# EAGLE schematic cs3 (EAGLE 8.5.1)
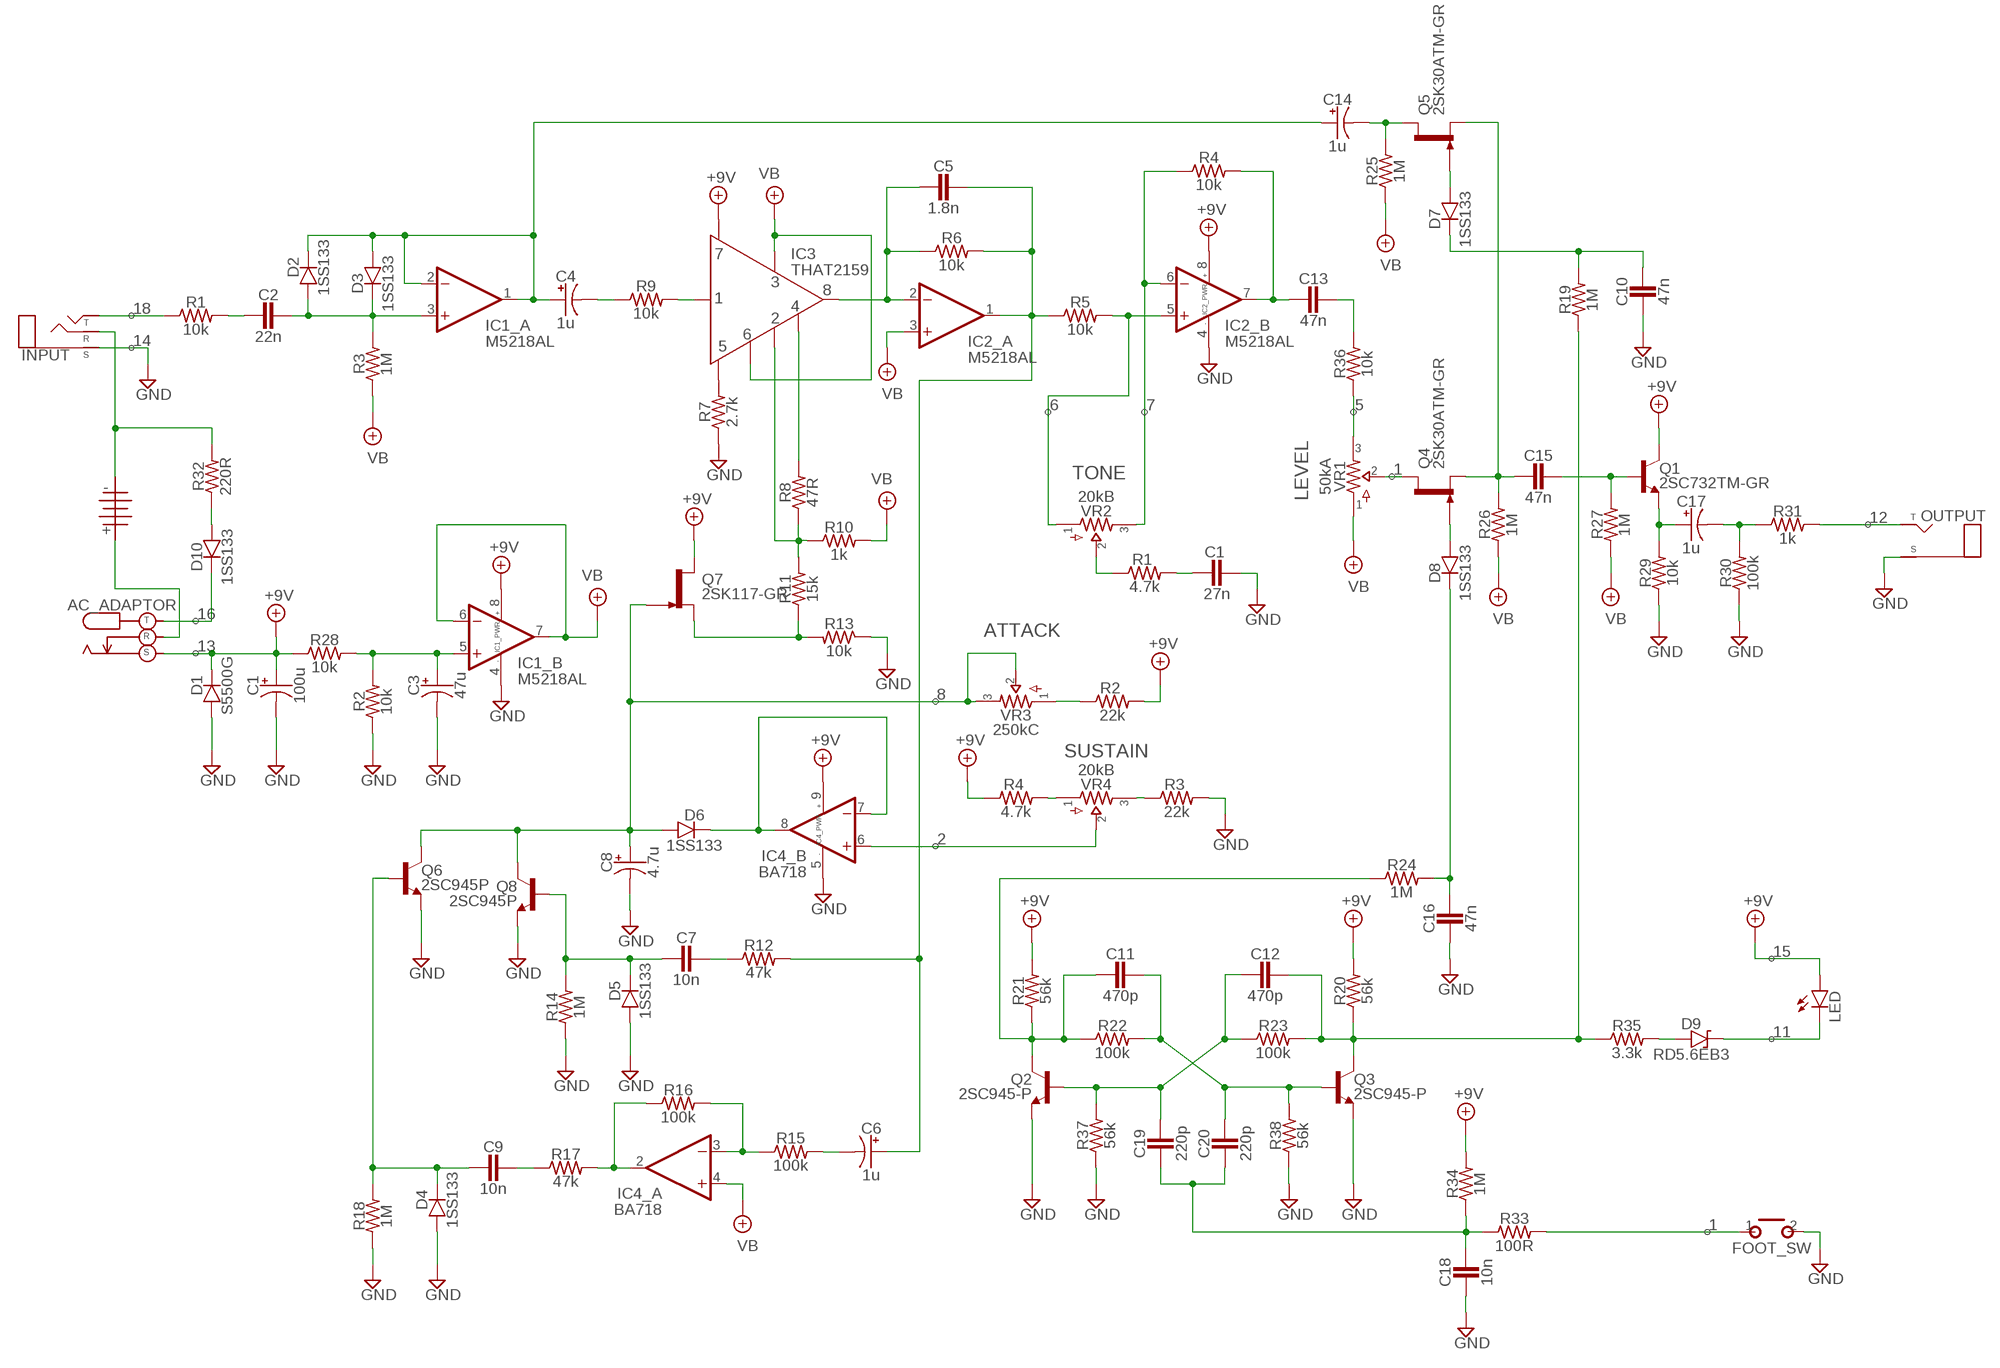
[diagram p0: schematic, sheet 1]

## Parts
1101  BATTERY  [TWO_PADS]
AC_ADAPTOR  DC_KOBICONN  [DC_KOBICONN]
C1  100u  0400  [040_020]
C1   27n  CER/FILMBOX.1  [BOX_SMALL]
C2  22n  CER/FILMBOX.1  [BOX_SMALL]
C3  47u  0400  [040_020]
C4  1u  0400  [040_020]
C5  1.8n  CER/FILMBOX.1  [BOX_SMALL]
C6  1u  0400  [040_020]
C7  10n  CER/FILMBOX.1  [BOX_SMALL]
C8  4.7u  0400  [040_020]
C9  10n  CER/FILMBOX.1  [BOX_SMALL]
C10  47n  CER/FILMBOX.1  [BOX_SMALL]
C11  470p  CER/FILMBOX.1  [BOX_SMALL]
C12  470p  CER/FILMBOX.1  [BOX_SMALL]
C13  47n  CER/FILMBOX.1  [BOX_SMALL]
C14  1u  0400  [040_020]
C15  47n  CER/FILMBOX.1  [BOX_SMALL]
C16  47n  CER/FILMBOX.1  [BOX_SMALL]
C17  1u  0400  [040_020]
C18  10n  CER/FILMBOX.1  [BOX_SMALL]
C19  220p  CER/FILMBOX.1  [BOX_SMALL]
C20  220p  CER/FILMBOX.1  [BOX_SMALL]
D1  S5500G  DO35.2  [DO35-2]
D2  1SS133  DO35.2  [DO35-2]
D3  1SS133  DO35.2  [DO35-2]
D4  1SS133  DO35.2  [DO35-2]
D5  1SS133  DO35.2  [DO35-2]
D6  1SS133  DO35.2  [DO35-2]
D7  1SS133  DO35.2  [DO35-2]
D8  1SS133  DO35.2  [DO35-2]
D9  RD5.6EB3  ZENER.2  [DO41-2]
D10  1SS133  DO35.2  [DO35-2]
FOOT_SW  MOMENTARY  [SPST]
IC1  M5218AL  DUALTH  [DIL0]
IC2  M5218AL  DUALTH  [DIL0]
IC3  THAT2159  THAT2181C  [SIL8]
IC4  BA718  DUAL  [SIL09]
INPUT  STEREO3PADS  [THREEPADS]
LED  LED  [3MM_D]
OUTPUT  MONO  [TWO_PADS]
Q1  2SC732TM-GR  2N3904  [TO92-]
Q2  2SC945-P  2SC828A  [TO92-]
Q3  2SC945-P  2SC828A  [TO92-]
Q4  2SK30ATM-GR  2N5457  [TO92-]
Q5  2SK30ATM-GR  2N5457  [TO92-]
Q6  2SC945P  2N3904  [TO92-]
Q7  2SK117-GR  2N5457  [TO92-]
Q8  2SC945P  2N3904  [TO92-]
R1  10k  R_.3B  [R0207/3]
R1   4.7k  R_.3B  [R0207/3]
R2  10k  R_.3B  [R0207/3]
R2   22k  R_.3B  [R0207/3]
R3  1M  R_.3B  [R0207/3]
R3   22k  R_.3B  [R0207/3]
R4  10k  R_.3B  [R0207/3]
R4   4.7k  R_.3B  [R0207/3]
R5  10k  R_.3B  [R0207/3]
R6  10k  R_.3B  [R0207/3]
R7  2.7k  R_.3B  [R0207/3]
R8  47R  R_.3B  [R0207/3]
R9  10k  R_.3B  [R0207/3]
R10  1k  R_.3B  [R0207/3]
R11  15k  R_.3B  [R0207/3]
R12  47k  R_.3B  [R0207/3]
R13  10k  R_.3B  [R0207/3]
R14  1M  R_.3B  [R0207/3]
R15  100k  R_.3B  [R0207/3]
R16  100k  R_.3B  [R0207/3]
R17  47k  R_.3B  [R0207/3]
R18  1M  R_.3B  [R0207/3]
R19  1M  R_.3B  [R0207/3]
R20  56k  R_.3B  [R0207/3]
R21  56k  R_.3B  [R0207/3]
R22  100k  R_.3B  [R0207/3]
R23  100k  R_.3B  [R0207/3]
R24  1M  R_.3B  [R0207/3]
R25  1M  R_.3B  [R0207/3]
R26  1M  R_.3B  [R0207/3]
R27  1M  R_.3B  [R0207/3]
R28  10k  R_.3B  [R0207/3]
R29  10k  R_.3B  [R0207/3]
R30  100k  R_.3B  [R0207/3]
R31  1k  R_.3B  [R0207/3]
R32  220R  R_.3B  [R0207/3]
R33  100R  R_.3B  [R0207/3]
R34  1M  R_.3B  [R0207/3]
R35  3.3k  R_.3B  [R0207/3]
R36  10k  R_.3B  [R0207/3]
R37  56k  R_.3B  [R0207/3]
R38  56k  R_.3B  [R0207/3]
VR1  50kA  POTS16MM  [16MM]
VR2  20kB  POTS16MM  [16MM]
VR3  250kC  POTS16MM  [16MM]
VR4  20kB  POTS16MM  [16MM]

## Nets
+9V: AC_ADAPTOR.S C1.+ D1.C IC1.8(_PWR:V+) IC2.8(_PWR:V+) IC3.7 IC4.9(_PWR:V+) LED.ANODE(A) Q1.1(C) Q7.3(D) R2 .2 R4 .1 R20.2 R21.2 R28.1 R34.2
GND: C1.- C1 .2 C3.- C8.- C10.2 C16.2 C18.2 D1.A D4.A D5.A FOOT_SW.2(S) IC1.4(_PWR:V-) IC2.4(_PWR:V-) IC4.5(_PWR:V-) INPUT.SLEEVE(S) OUTPUT.S(SLEEVE) Q2.3(E) Q3.3(E) Q6.3(E) Q8.3(E) R2.1 R3 .2 R7.1 R13.1 R14.1 R18.1 R29.1 R30.1 R37.1 R38.1
N$1: C3.+ IC1.5(_B:+IN) R2.2 R28.2
N$2: INPUT.TIP(T) R1.1
N$3: AC_ADAPTOR.T D10.C
N$4: D10.A R32.1
N$5: C2.2 R1.2
N$6: C18.1 C19.2 C20.2 R33.1 R34.1
N$7: C2.1 D2.A D3.C IC1.3(_A:+IN) R3.2
N$8: C4.+ C14.+ D2.C D3.A IC1.1(_A:OUT) IC1.2(_A:-IN)
N$9: IC3.5 R7.2
N$10: C4.- R9.1
N$11: IC3.1 R9.2
N$12: IC3.4 R8.2
N$13: IC3.2 R8.1 R10.1 R11.2
N$14: Q7.2(S) R11.1 R13.2
N$15: C5.2 IC2.2(_A:-IN) IC3.8 R6.1
N$16: C17.+ Q1.3(E) R29.2
N$17: IC2.5(_B:+IN) R5.2 VR2.1
N$18: IC2.6(_B:-IN) R4.1 VR2.3
N$19: C13.2 IC2.7(_B:OUT) R4.2
N$20: C13.1 R36.2
N$21: R36.1 VR1.3
N$22: R1 .1 VR2.2
N$23: C1 .1 R1 .2
N$24: C14.- Q5.3(D) R25.2
N$25: Q4.3(D) VR1.2
N$26: C15.2 Q4.2(S) Q5.2(S) R26.2
N$27: 1101.T AC_ADAPTOR.R
N$28: 1101.S INPUT.RING(R) R32.2
N$29: C11.2 Q2.2(C) R21.1 R22.1 R24.1
N$30: C15.1 Q1.2(B) R27.2
N$31: D8.A Q4.1(G)
N$32: C12.2 C19.1 Q2.1(B) R23.1 R37.2
N$33: D7.A Q5.1(G)
N$34: C11.1 C20.1 Q3.1(B) R22.2 R38.2
N$35: IC4.6(_B:+IN) VR4.2
N$36: R2 .1 VR3.1
N$37: C8.+ D6.A Q6.1(C) Q7.1(G) Q8.1(C) VR3.2 VR3.3
N$38: D6.C IC4.7(_B:-IN) IC4.8(_B:OUT)
N$39: R4 .2 VR4.1
N$40: R3 .1 VR4.3
N$41: C9.2 D4.C Q6.2(B) R18.2
N$42: C7.2 D5.C Q8.2(B) R14.2
N$43: C7.1 R12.1
N$44: C9.1 R17.1
N$45: IC4.2(_A:OUT) R16.1 R17.2
N$46: C17.- R30.2 R31.1
N$47: IC4.3(_A:-IN) R15.1 R16.2
N$48: C6.- R15.2
N$49: OUTPUT.T(TIP) R31.2
N$50: C5.1 C6.+ IC2.1(_A:OUT) R5.1 R6.2 R12.2
N$51: C10.1 D7.C R19.2
N$52: C16.1 D8.C R24.2
N$53: D9.A R35.2
N$54: D9.C LED.P$1(C)
N$55: FOOT_SW.1(P) R33.2
N$75: C12.1 Q3.2(C) R19.1 R20.1 R23.2 R35.1
VB: IC1.6(_B:-IN) IC1.7(_B:OUT) IC2.3(_A:+IN) IC3.3 IC3.6 IC4.4(_A:+IN) R3.1 R10.2 R25.1 R26.1 R27.1 VR1.1

## Notes on the sheet
- 18
- 14
- 6 | 7 | 5
- 1
- TONE
- LEVEL
- 12
- 16
- ATTACK
- 13
- 8
- SUSTAIN
- 2
- 15
- 11
- 1

## Library data of the parts
1101 = pedals-jacks:BATTERY
AC_ADAPTOR = pedals-jacks:DC_KOBICONN
C1 C3 C4 C6 C8 C14 C17 = pedals-capacitors-elec:040
C1  C2 C5 C7 C9-C13 C15 C16 C18-C20 = pedals-capacitors-film:CER/FILM: 47 - 120pF Xicon Ceramic Disc 2.5mm lead spacing
D1-D8 D10 = pedals-diodes:DO35: DO-35 Package Diodes: 1N914
D9 = pedals-diodes:ZENER
FOOT_SW = pedals-switches:MOMENTARY
IC1 IC2 IC4 = pedals-integrated circuits:DUAL: OP AMP
IC3 = pedals-integrated circuits:THAT2181C
INPUT = pedals-jacks:STEREO
LED = pedals-diodes:LED
OUTPUT = pedals-jacks:MONO: Mono 1/4" Phone Jack
Q1 Q6 Q8 = pedals-transistors:2N3904: NPN Transistor
Q2 Q3 = pedals-transistors:2SC828A
Q4 Q5 Q7 = pedals-transistors:2N5457: N-CHANNEL JFET
R1 R1  R2 R2  R3 R3  R4 R4  R5-R38 = pedals-resistors:R_
VR1-VR4 = pedals-potentiometers:POTS